# EasyEDA Pro project Main.eprj, schematic Teensy4.1
Board Name: Teensy4.1; Create Date: 2026-01-29; Page Name: v1; Project Name: Main; Schematic Name: Teensy4.1; Update Date: 2026-05-22; File: powermanagmen; Id: /; Sheet: /
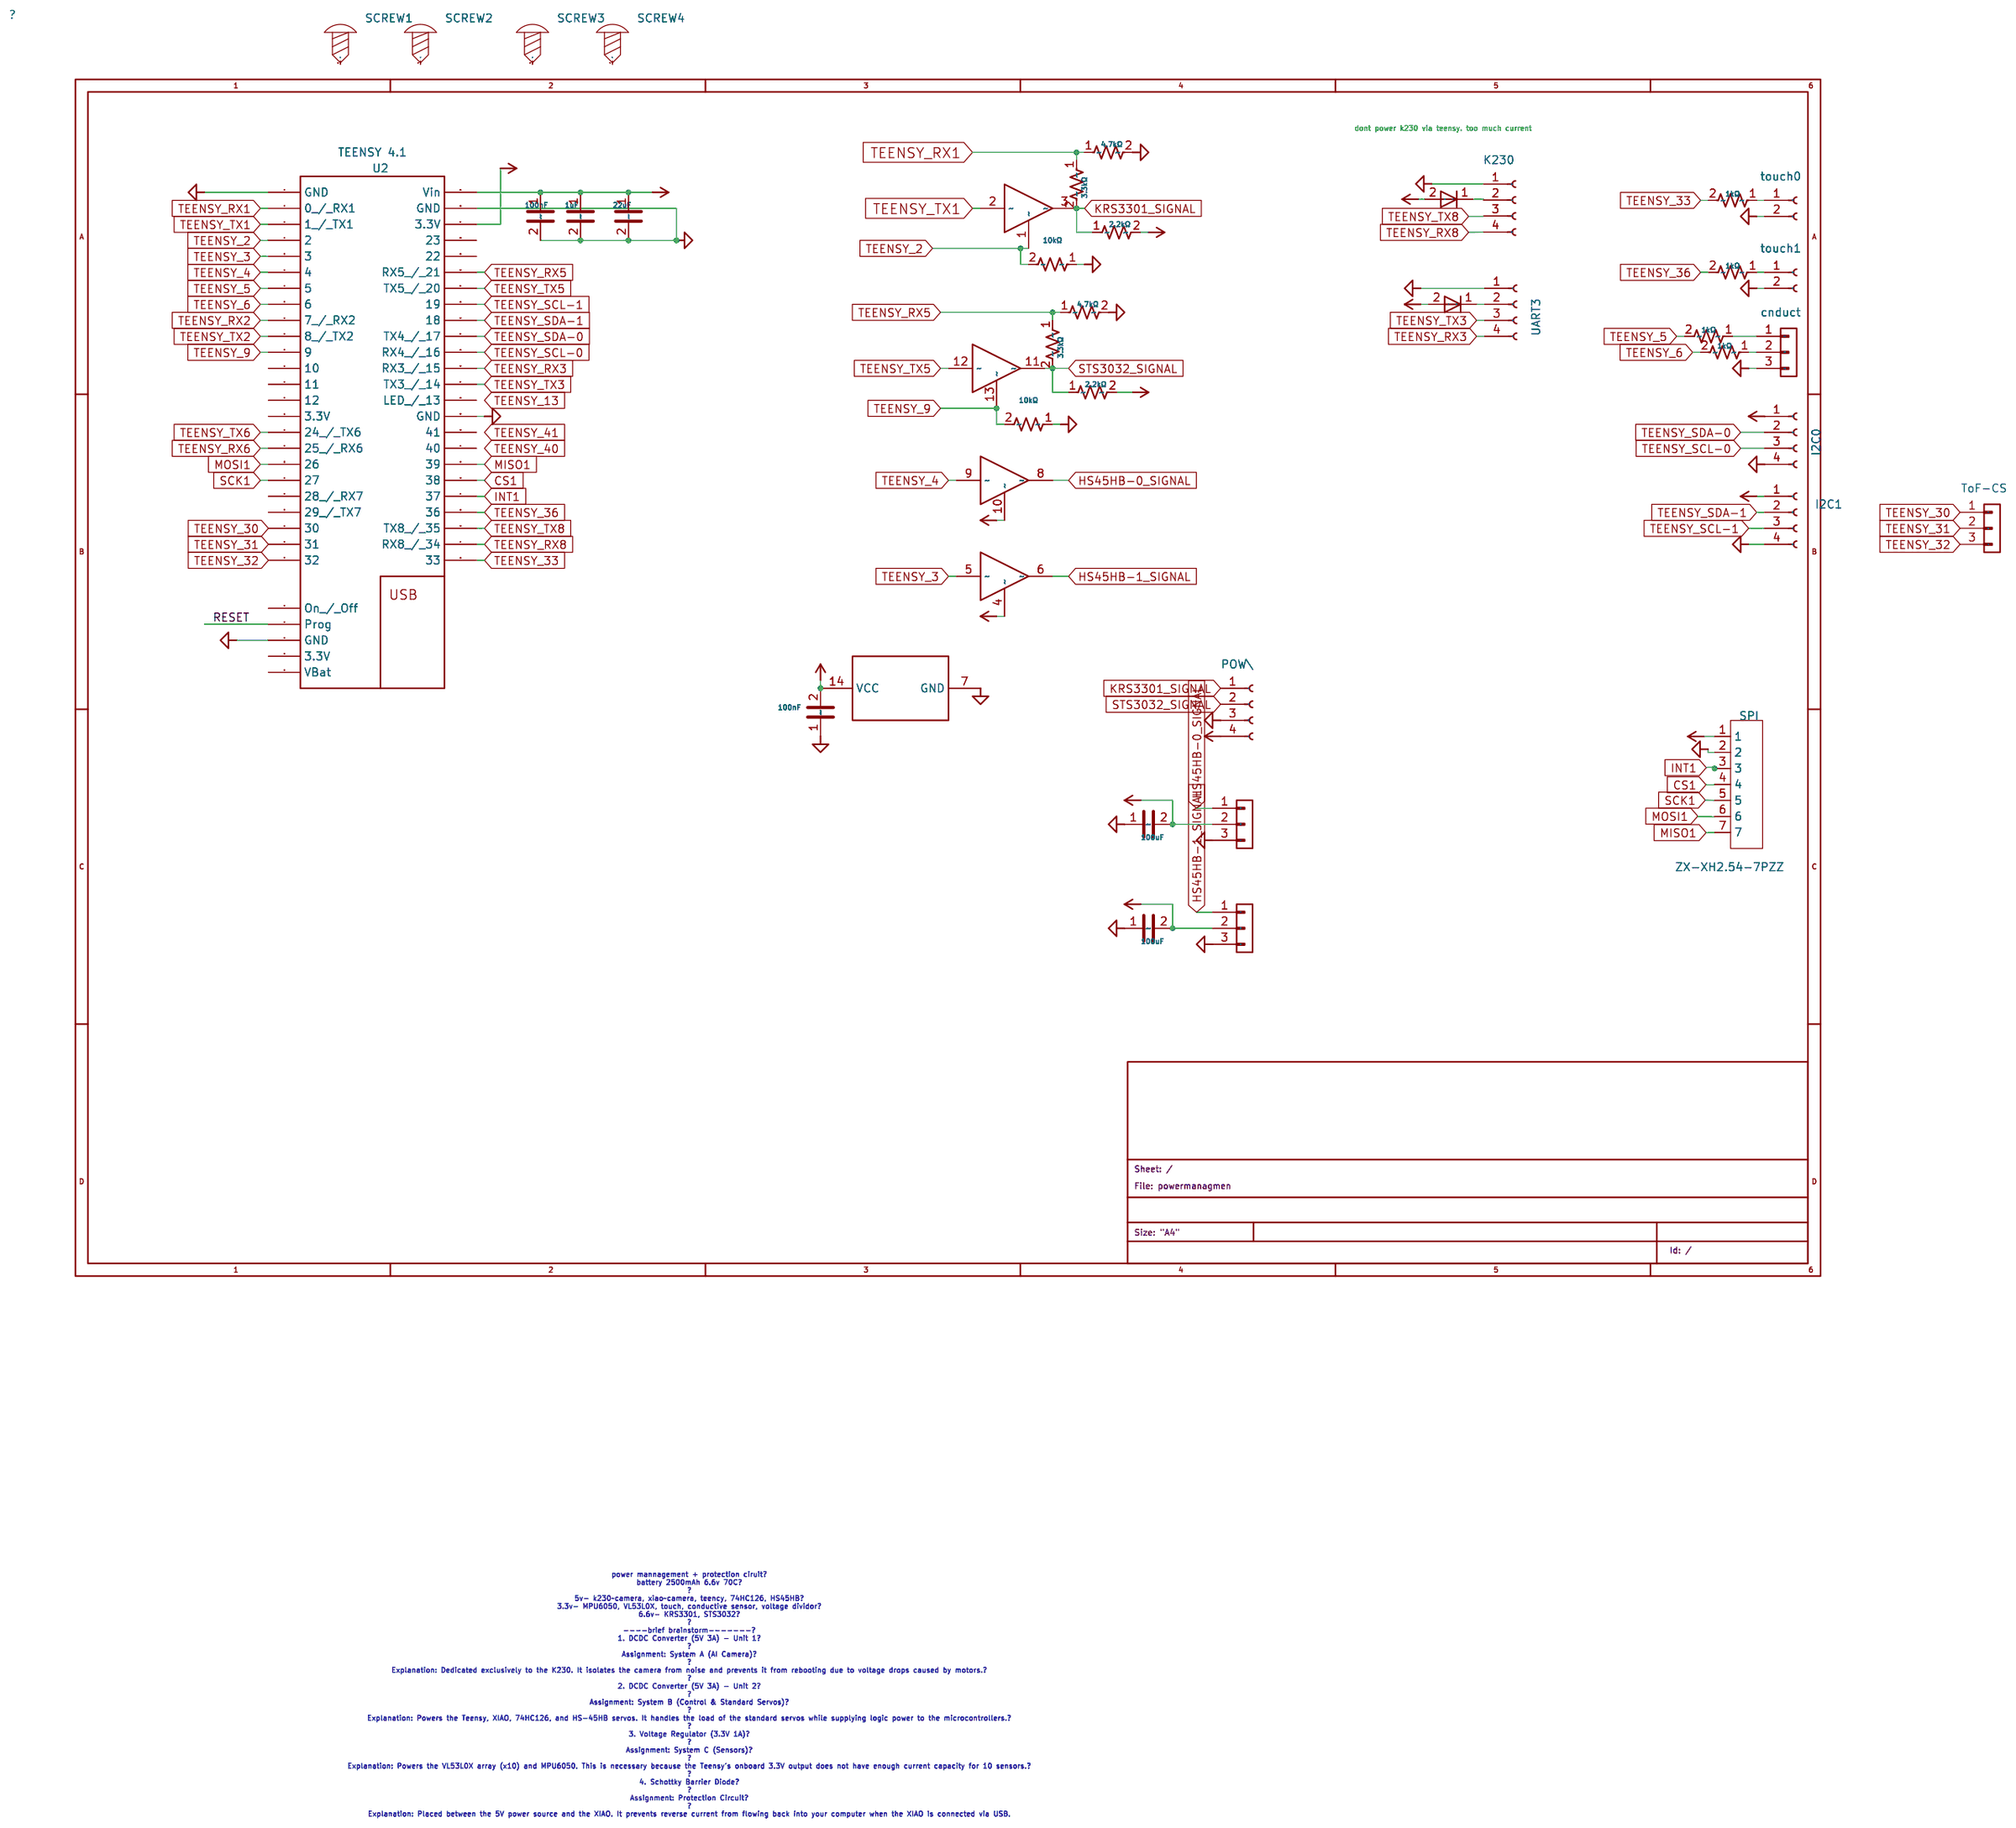
[diagram p1: schematic sheet]

## Parts
C1  100nF  [C0603]
C2  22uF  [C0603]
C3  1uF  [C0603]
C4  100nF  [C0603]
C56  100uF  [C0603]
C57  100uF  [C0603]
D1  BAT60B  [SOD-323_L1.7-W1.3-LS2.6-RD-1]
D2  BAT60B  [SOD-323_L1.7-W1.3-LS2.6-RD-1]
J2  POW\  [CONN-TH_4P-P2.50_4PIN]
J3  UART3  [CONN-TH_4P-P2.50_4PIN]
J4  I2C0  [CONN-TH_4P-P2.50_4PIN]
J6  I2C1  [CONN-TH_4P-P2.50_4PIN]
J8  touch0  [CONN-TH_2P-P2.50_HX25003-2A]
J9  touch1  [CONN-TH_2P-P2.50_HX25003-2A]
J10  cnduct  [CONN-TH_3P-P2.50_BX-XH2.54-3PZZ]
J15  PZ254V-11-03P  [HDR-TH_3P-P2.54-V-M_PZ254V-11-03P]
J16  PZ254V-11-03P  [HDR-TH_3P-P2.54-V-M_PZ254V-11-03P]
J17  ToF-CS  [CONN-TH_3P-P2.50_BX-XH2.54-3PZZ]
J18  K230  [CONN-TH_4P-P2.50_4PIN]
R1  10kΩ  [R0603]
R2  3.3kΩ  [R0603]
R3  4.7kΩ  [R0603]
R4  2.2kΩ  [R0603]
R5  1kΩ  [R0603]
R6  1kΩ  [R0603]
R7  1kΩ  [R0603]
R8  1kΩ  [R0603]
R9  4.7kΩ  [R0603]
R10  3.3kΩ  [R0603]
R11  10kΩ  [R0603]
R12  2.2kΩ  [R0603]
SCREW1  -  [Screw-Hole-M2]
SCREW2  -  [Screw-Hole-M2]
SCREW3  -  [Screw-Hole-M2]
SCREW4  -  [Screw-Hole-M2]
SPI  ZX-XH2.54-7PZZ  [CONN-TH_7P-P2.50_ZX-XH2.54-7PZZ]
U1  CD74HCT126M96  [SOIC-14_L8.7-W3.9-P1.27-LS6.0-BL]  (sections 1,2,3,4,5)
U2  TEENSY 4.1  [TEENSY 4.1]

## Library data of the parts
C1 C4 C56 C57 = TCC0603X7R104K500CT: Capacitance:100nF Tolerance:±10% Tolerance:±10% Voltage Rating:50V Temperature Coefficient:X7R; LCSC Part Name: 100nF ±10% 50V; Supplier Part: C282519; Manufacturer: CCTC(三环); Supplier Footprint: 0603; JLCPCB Part Class: Extended Part; Datasheet: https://item.szlcsc.com/datasheet/TCC0603X7R104K500CT/268639.html; Supplier: LCSC; Tolerance: ±10%; Voltage Rating: 50V; Temperature Coefficient: X7R
C2 = CL10A226MP8NUNE: Capacitance:22uF Tolerance:±20% Tolerance:±20% Voltage Rating:10V Temperature Coefficient:X5R; LCSC Part Name: 22uF ±20% 10V; Supplier Part: C86295; Manufacturer: SAMSUNG(三星); Supplier Footprint: 0603; JLCPCB Part Class: Extended Part; Datasheet: https://item.szlcsc.com/datasheet/CL10A226MP8NUNE/87471.html; Supplier: LCSC; Tolerance: ±20%; Voltage Rating: 10V; Temperature Coefficient: X5R
C3 = CL10A105KB8NNNC: Capacitance:1uF Tolerance:±10% Tolerance:±10% Voltage Rating:50V Temperature Coefficient:X5R; LCSC Part Name: 1uF ±10% 50V; Supplier Part: C15849; Manufacturer: SAMSUNG(三星); Supplier Footprint: 0603; JLCPCB Part Class: Basic Part; Datasheet: https://item.szlcsc.com/datasheet/CL10A105KB8NNNC/16531.html; Supplier: LCSC; Tolerance: ±10%; Voltage Rating: 50V; Temperature Coefficient: X5R
D1 D2 = BAT60B_C7502695: Diode Configuration:Independent Voltage - Forward(Vf@If):600mV@1A Voltage - DC Reverse(Vr):10V Current - Rectified:3A Reverse Leakage Current (Ir):25uA Non-Repetitive Peak Forward Surge Current:5A; LCSC Part Name: 电压:10V 电流:3A; Supplier Part: C7502695; Manufacturer: R+O(宏嘉诚); Supplier Footprint: SOD-323; JLCPCB Part Class: Extended Part; Datasheet: https://item.szlcsc.com/datasheet/BAT60B/8589412.html; Supplier: LCSC; Diode Configuration: Independent; Voltage - Forward(Vf@If): 600mV@1A; Voltage - DC Reverse(Vr): 10V; Current - Rectified: 3A; Reverse Leakage Current (Ir): 25uA; Non-Repetitive Peak Forward Surge Current: 5A
J2-J4 J6 J18 = ZX-XH2.54-4PZZ: LCSC Part Name: 1x4P 间距:2.5mm 直插 系列:XH; Supplier Part: C7429634; Manufacturer: Megastar(兆星); Supplier Footprint: 插件,P=2.5mm; JLCPCB Part Class: Extended Part; Datasheet: https://item.szlcsc.com/datasheet/ZX-XH2.54-4PZZ/8427551.html; Supplier: LCSC; Pins Structure: 1x4P; Pitch: 2.5mm; Mounting Type: Through Hole; Reference Series: XH; Number of Pins: 4P; Number of Rows: 1; Number of PINs Per Row: 4; Current Rating: 3A; Contact Material: Brass; Contact Plating: Tin; Operating Temperature: -25℃~+85℃; Voltage Rating: 250V; Plastic Material: PA66; Flame Retardant Rating: UL94V-0; Color: White; Z-Height of the Board: 7mm; X-Length of Bottom Edge on Board (Spacing Line): 12.5mm; Y-Width of Bottom Edge on Board: 5.9mm
J8 J9 = ZX-XH2.54-2PZZ: Pins Structure:1x2P Pitch:2.5mm Mounting Type:Through Hole Reference Series:XH Number of Pins:2P Number of Rows:1 Number of PINs Per Row:2 Row Spacing:- Current Rating:2A Contact Material:Brass Contact Plating:Tin Operating Temperature:-25℃~+85℃ Operating; LCSC Part Name: 1x2P 间距:2.5mm 直插 系列:XH; Supplier Part: C7429632; Manufacturer: Megastar(兆星); Supplier Footprint: 插件,P=2.5mm; JLCPCB Part Class: Extended Part; Datasheet: https://item.szlcsc.com/datasheet/ZX-XH2.54-2PZZ/8427549.html; Supplier: LCSC; Pins Structure: 1x2P; Pitch: 2.5mm; Mounting Type: Through Hole; Reference Series: XH; Number of Pins: 2P; Number of Rows: 1; Number of PINs Per Row: 2; Current Rating: 2A; Contact Material: Brass; Contact Plating: Tin; Operating Temperature: -25℃~+85℃; Voltage Rating: 250V; Plastic Material: PA66; Flame Retardant Rating: UL94V-0; Color: White; Z-Height of the Board: 7mm; X-Length of Bottom Edge on Board (Spacing Line): 7.5mm; Y-Width of Bottom Edge on Board: 5.9mm
J10 J17 = B3B-XH-A(LF)(SN): Pins Structure:1x3P Pitch:2.5mm Mounting Type:Through Hole Reference Series:XH Number of Pins:3P Number of Rows:1 Number of PINs Per Row:3 Row Spacing:- Current Rating:3A Contact Material:Brass Contact Plating:Tin Operating Temperature:-25℃~+85℃ Operating; LCSC Part Name: 1x3P 间距:2.5mm 直插 系列:XH; Supplier Part: C144394; Manufacturer: JST; Supplier Footprint: 插件,P=2.5mm; JLCPCB Part Class: Extended Part; Datasheet: https://item.szlcsc.com/datasheet/B3B-XH-A(LF)(SN)/155726.html; Supplier: LCSC; Pins Structure: 1x3P; Pitch: 2.5mm; Mounting Type: Through Hole; Reference Series: XH; Number of Pins: 3P; Number of Rows: 1; Number of PINs Per Row: 3; Current Rating: 3A; Contact Material: Brass; Contact Plating: Tin; Operating Temperature: -25℃~+85℃; Voltage Rating: 250V; Plastic Material: PA66; Flame Retardant Rating: UL94V-0; Supplementary Features: K Pin; Color: White; Z-Height of the Board: 7mm; X-Length of Bottom Edge on Board (Spacing Line): 9.9mm; Y-Width of Bottom Edge on Board: 5.75mm
J15 J16 = PZ254V-11-03P: Pin Structure:1x3P Pitch:2.54mm Row Spacing:- Circluar Pins/Square Pins:Pin Header Mounting Type:Through Hole Number of Rows:1 Number of Pins:3P Current Rating:3A Voltage Rating (Max):250V Length of Mating Pin:6mm Insulation Height:2.5mm Length of End Con; LCSC Part Name: 1x3P 间距:2.54mm 方针 直插; Supplier Part: C2937625; Manufacturer: XFCN(兴飞); Supplier Footprint: 插件,P=2.54mm; JLCPCB Part Class: Extended Part; Datasheet: https://item.szlcsc.com/datasheet/PZ254V-11-03P/3293280.html; Supplier: LCSC; Pin Structure: 1x3P; Pitch: 2.54mm; Circluar Pins/Square Pins: Pin Header; Mounting Type: Through Hole; Number of Rows: 1; Number of Pins: 3P; Current Rating: 3A; Voltage Rating (Max): 250V; Length of Mating Pin: 6mm; Insulation Height: 2.5mm; Length of End Connection Pin: 3mm; Operating Temperature: -40℃~+105℃; Color: Black
R1 R11 = 0603WAF1002T5E: Type:Thick Film Resistor Resistance:10kΩ Tolerance:±1% Tolerance:±1% Power(Watts):100mW Voltage-Supply(Max):75V Temperature Coefficient:±100ppm/℃ Temperature Coefficient:±100ppm/℃ Operating Temperature:-55℃~+155℃ Operating Temperature:-55℃~+155℃; LCSC Part Name: 厚膜电阻 10kΩ ±1% 100mW; Supplier Part: C25804; Manufacturer: UNI-ROYAL(厚声); Supplier Footprint: 0603; JLCPCB Part Class: Basic Part; Datasheet: https://item.szlcsc.com/datasheet/0603WAF1002T5E/26547.html; Supplier: LCSC; Type: Thick Film Resistor; Tolerance: ±1%; Power(Watts): 100mW; Voltage-Supply(Max): 75V; Temperature Coefficient: ±100ppm/℃; Operating Temperature: -55℃~+155℃
R2-R4 R9 R10 R12 = 0603WAF2201T5E_C4190: Type:Thick Film Resistors Resistance:2.2kΩ Tolerance:±1% Tolerance:±1% Power(Watts): Overload Voltage (Max): Temperature Coefficient:±100ppm/℃ Temperature Coefficient:±100ppm/℃ Operating Temperature Range:-55℃~+155℃ Operating Temperature Range:-55℃~+155℃; LCSC Part Name: 2.2kΩ ±1% 100mW 厚膜电阻; Supplier Part: C4190; Manufacturer: UNI-ROYAL(厚声); Manufacturer Part: 0603WAF2201T5E; Supplier Footprint: 0603; JLCPCB Part Class: Basic Part; Datasheet: https://atta.szlcsc.com/upload/public/pdf/source/20200306/C422600_1E6D84923E4A46A82E41ADD87F860B5C.pdf; Supplier: LCSC; Type: Thick Film Resistors; Tolerance: ±1%; Temperature Coefficient: ±100ppm/℃; Operating Temperature Range: -55℃~+155℃
R5-R8 = 0603WAF4700T5E: Type:Thick Film Resistor Resistance:470Ω Tolerance:±1% Tolerance:±1% Power(Watts):100mW Voltage-Supply(Max):75V Temperature Coefficient:±100ppm/℃ Temperature Coefficient:±100ppm/℃ Operating Temperature:-55℃~+155℃ Operating Temperature:-55℃~+155℃; LCSC Part Name: 470Ω ±1% 100mW 厚膜电阻; Supplier Part: C23179; Manufacturer: UNI-ROYAL(厚声); Supplier Footprint: 0603; JLCPCB Part Class: Basic Part; Datasheet: https://item.szlcsc.com/datasheet/0603WAF4700T5E/23906.html; Supplier: LCSC; Type: Thick Film Resistor; Tolerance: ±1%; Power(Watts): 100mW; Voltage-Supply(Max): 75V; Temperature Coefficient: ±100ppm/℃; Operating Temperature: -55℃~+155℃
SCREW1-SCREW4 = Screw-Hole-M2: Supplier Footprint: 插件
SPI = ZX-XH2.54-7PZZ: LCSC Part Name: 1x7P 间距:2.5mm 直插 系列:XH; Supplier Part: C7429637; Manufacturer: Megastar(兆星); Supplier Footprint: 插件,P=2.5mm; JLCPCB Part Class: Extended Part; Datasheet: https://item.szlcsc.com/datasheet/ZX-XH2.54-7PZZ/8427554.html; Supplier: LCSC; Pins Structure: 1x7P; Pitch: 2.5mm; Mounting Type: Through Hole; Reference Series: XH; Number of Pins: 7P; Number of Rows: 1; Number of PINs Per Row: 7; Current Rating: 3A; Contact Material: Brass; Contact Plating: Tin; Operating Temperature: -25℃~+85℃; Voltage Rating: 250V; Plastic Material: PA66; Flame Retardant Rating: UL94V-0; Color: White; Z-Height of the Board: 7mm; X-Length of Bottom Edge on Board (Spacing Line): 20mm; Y-Width of Bottom Edge on Board: 5.9mm
U1 = CD74HCT126M96: Supplier Part: C2675949; Manufacturer: TI(德州仪器); Supplier Footprint: SOIC-14; JLCPCB Part Class: Extended Part; Datasheet: https://www.ti.com/cn/lit/gpn/cd74hct126; Supplier: LCSC; output type: Tri-State; Voltage - Supply: 4.5V~5.5V; Number of Elements: 4; Number of Bits per Element: 1; Current - Output Low(IOL): 6mA; Current - Output High(IOH): 6mA; Logic Family: 74HCT; Operating Temperature: -55℃~+125℃
U2 = TEENSY 4.1

## Nets
+3.3V: J4.1(Pin) J6.1(Pin) U2.27(3.3V)
+5V: C1.2 C2.1 C3.1 C4.1 C56.2 C57.2 D1.2(A) D2.2(A) J2.4(Pin) J15.2(Pin) J16.2(Pin) R4.2 R12.2 U1.4 U1.10 U1.14(VCC) U2.25(Vin)
CS1: U2.43(38)
HS45HB-0_SIGNAL: J15.1(Pin) U1.8
HS45HB-1_SIGNAL: J16.1(Pin) U1.6
INT1: SPI.3 U2.44(37)
KRS3301_SIGNAL: J2.1(Pin) R2.2 R4.1 U1.3
MISO1: SPI.7 U2.42(39)
MOSI1: U2.18(26)
POWER_GND: C1.1 C2.2 C3.2 C4.2 C56.1 C57.1 J2.3(Pin) J3.1(Pin) J4.4(Pin) J6.4(Pin) J8.2(Pin) J9.2(Pin) J10.3(Pin) J15.3(Pin) J16.3(Pin) R1.1 R3.2 R9.2 R11.1 SPI.2 U1.7(GND) U2.1(GND) U2.26(GND) U2.39(GND) U2.51(GND)
RESET: U2.50(Prog)
SCK1: SPI.5 U2.19(27)
STS3032_SIGNAL: J2.2(Pin) R10.2 R12.1 U1.11
TEENSY_2: R1.2 U1.1 U2.4(2)
TEENSY_3: U1.5 U2.5(3)
TEENSY_4: U1.9 U2.6(4)
TEENSY_5: R8.2 U2.7(5)
TEENSY_6: R7.2 U2.8(6)
TEENSY_9: R11.2 U1.13 U2.11(9)
TEENSY_30: J17.1(Pin) U2.22(30)
TEENSY_31: J17.2(Pin) U2.23(31)
TEENSY_32: J17.3(Pin) U2.24(32)
TEENSY_33: R6.2 U2.48(33)
TEENSY_36: R5.2 U2.45(36)
TEENSY_RX1: R2.1 R3.1 U2.2(0 / RX1)
TEENSY_RX2: U2.9(7 / RX2)
TEENSY_RX3: J3.4(Pin) U2.36(RX3 / 15)
TEENSY_RX5: R9.1 R10.1 U2.30(RX5 / 21)
TEENSY_RX6: U2.17(25 / RX6)
TEENSY_RX8: J18.4(Pin) U2.47(RX8 / 34)
TEENSY_SCL-0: J4.3(Pin) U2.35(RX4 / 16)
TEENSY_SCL-1: J6.3(Pin) U2.32(19)
TEENSY_SDA-0: J4.2(Pin) U2.34(TX4 / 17)
TEENSY_SDA-1: J6.2(Pin) U2.33(18)
TEENSY_TX1: U1.2 U2.3(1 / TX1)
TEENSY_TX2: U2.10(8 / TX2)
TEENSY_TX3: J3.3(Pin) U2.37(TX3 / 14)
TEENSY_TX5: U1.12 U2.31(TX5 / 20)
TEENSY_TX6: U2.16(24 / TX6)
TEENSY_TX8: U2.46(TX8 / 35)
$1N12604: J10.1(Pin) R8.1
$1N12618: J8.1(Pin) R6.1
$1N12632: J10.2(Pin) R7.1
$1N12638: J9.1(Pin) R5.1
$1N65243: D1.1(K) J3.2(Pin)
$1N99968: D2.1(K) J18.2(Pin)

Not connected (* = marked no-connect by the designer): J18 1(Pin) 3(Pin); SCREW1 1; SCREW2 1; SCREW3 1; SCREW4 1; SPI 1 4 6; U2 12(10) 13(11) 14(12) 15(3.3V) 20(28 / RX7) 21(29 / TX7) 28(23) 29(22) 38(LED / 13) 40(41) 41(40) 49(On / Off) 52(3.3V) 53(VBat)

## Notes on the sheet
- dont power k230 via teensy. too much current
- power mannagement + protection ciruit
  battery 2500mAh 6.6v 70C
  5v- k230~camera, xiao~camera, teency, 74HC126, HS45HB
  3.3v- MPU6050, VL53L0X, touch, conductive sensor, voltage dividor
  6.6v- KRS3301, STS3032
  ----brief brainstorm-------
  1. DCDC Converter (5V 3A) - Unit 1
  Assignment: System A (AI Camera)
  Explanation: Dedicated exclusively to the K230. It isolates the camera from noise and prevents it from rebooting due to voltage drops caused by motors.
  2. DCDC Converter (5V 3A) - Unit 2
  Assignment: System B (Control & Standard Servos)
  Explanation: Powers the Teensy, XIAO, 74HC126, and HS-45HB servos. It handles the load of the standard servos while supplying logic power to the microcontrollers.
  3. Voltage Regulator (3.3V 1A)
  Assignment: System C (Sensors)
  Explanation: Powers the VL53L0X array (x10) and MPU6050. This is necessary because the Teensy's onboard 3.3V output does not have enough current capacity for 10 sensors.
  4. Schottky Barrier Diode
  Assignment: Protection Circuit
  Explanation: Placed between the 5V power source and the XIAO. It prevents reverse current from flowing back into your computer when the XIAO is connected via USB.
